# EAGLE schematic iobaord (EAGLE 9.6.2)
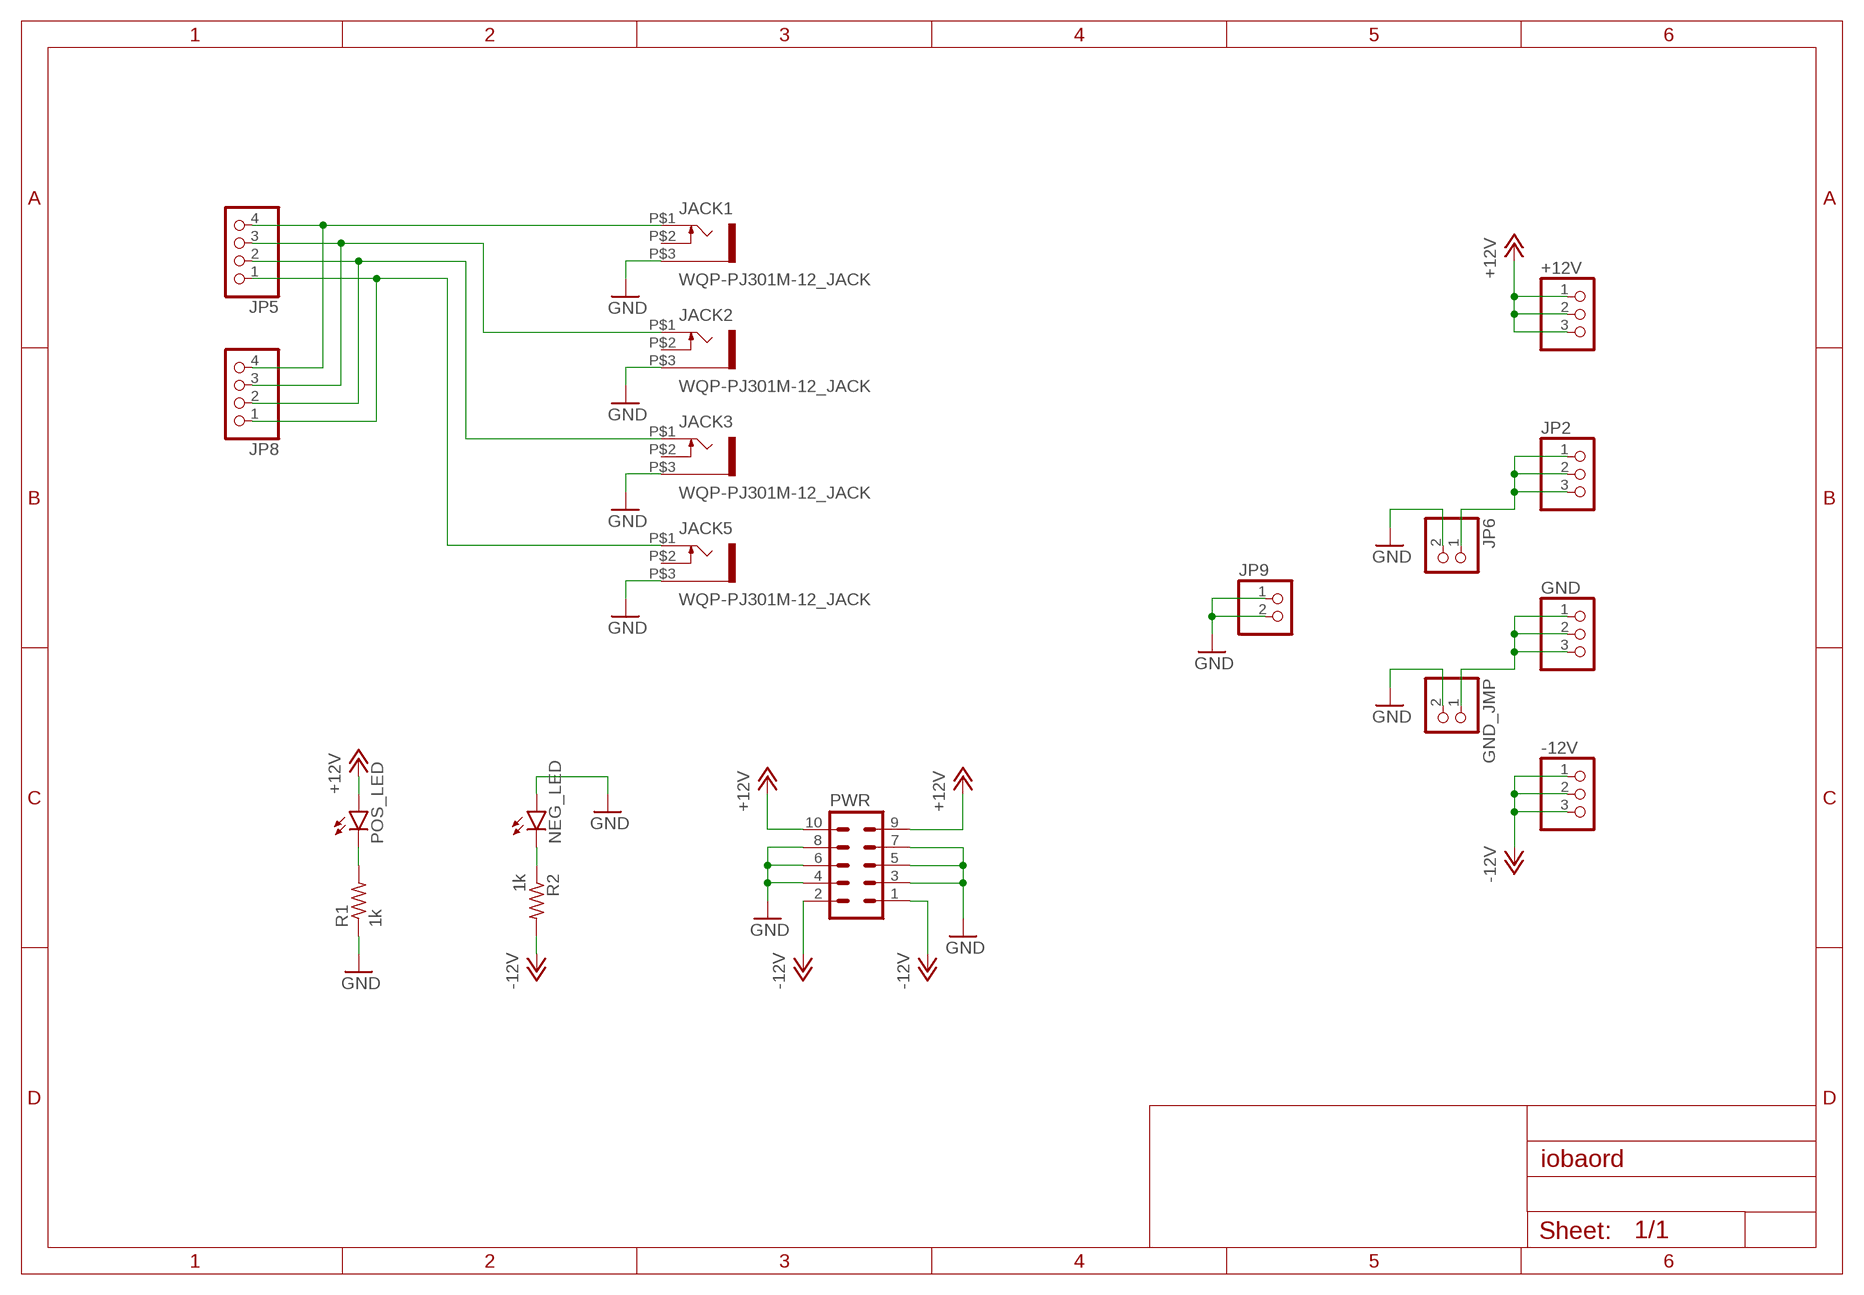
[diagram p0: schematic, sheet 1]

## Parts
+12V  PINHD-1X3  [1X03]
-12V  PINHD-1X3  [1X03]
GND  PINHD-1X3  [1X03]
GND_JMP  PINHD-1X2  [1X02]
JACK1  WQP-PJ301M-12_JACK  [WQP-PJ301M-12_JACK]
JACK2  WQP-PJ301M-12_JACK  [WQP-PJ301M-12_JACK]
JACK3  WQP-PJ301M-12_JACK  [WQP-PJ301M-12_JACK]
JACK5  WQP-PJ301M-12_JACK  [WQP-PJ301M-12_JACK]
JP2  PINHD-1X3  [1X03]
JP5  PINHD-1X4  [1X04]
JP6  PINHD-1X2  [1X02]
JP8  PINHD-1X4  [1X04]
JP9  PINHD-1X2  [1X02]
NEG_LED  LED3MM  [LED3MM]
POS_LED  LED3MM  [LED3MM]
PWR  ML10  [ML10]
R1  1k  R-US_0207/7  [0207/7]
R2  1k  R-US_0207/7  [0207/7]

## Nets
+12V: +12V.1 +12V.2 +12V.3 POS_LED.A PWR.9 PWR.10
-12V: -12V.1 -12V.2 -12V.3 PWR.1 PWR.2 R2.2
GND: GND_JMP.2 JACK1.P$3 JACK2.P$3 JACK3.P$3 JACK5.P$3 JP6.2 JP9.1 JP9.2 NEG_LED.A PWR.3 PWR.4 PWR.5 PWR.6 PWR.7 PWR.8 R1.1
N$1: POS_LED.K(C) R1.2
N$2: NEG_LED.K(C) R2.1
N$3: JACK1.P$1 JP5.4 JP8.4
N$5: JACK3.P$1 JP5.2 JP8.2
N$6: JP2.1 JP2.2 JP2.3 JP6.1
N$7: JACK5.P$1 JP5.1 JP8.1
N$9: GND.1 GND.2 GND.3 GND_JMP.1
N$10: JACK2.P$1 JP5.3 JP8.3
Unconnected: JACK1.P$2 JACK2.P$2 JACK3.P$2 JACK5.P$2

## Library data of the parts
+12V -12V GND JP2 = pinhead:PINHD-1X3: PIN HEADER
GND_JMP JP6 JP9 = pinhead:PINHD-1X2: PIN HEADER
JACK1-JACK3 JACK5 = thonkiconn:WQP-PJ301M-12_JACK
JP5 JP8 = pinhead:PINHD-1X4: PIN HEADER
NEG_LED POS_LED = led:LED: LED OSRAM: - CHIPLED LG R971, LG N971, LY N971, LG Q971, LY Q971, LO R971, LY R971 LH N974, LH R974 LS Q976, LO Q976, LY Q976 LO Q996 - Hyper CHIPLED LW Q18S LB Q993, LB Q99A, LB R99A - SideLED LS A670, LO A670, LY A670, LG A670, LP A670 LB A673, LV A673, LT A673, LW A673 LH A674 LY A675 LS A676, LA A676, LO A676, LY A676, LW A676 LS A679, LY A679, LG A679 - Hyper Micro SIDELED® LS Y876, LA Y876, LO Y876, LY Y876 LT Y87S - SmartLED LW L88C, LW L88S LB L89C, LB L89S, LG L890 LS L89K, LO L89K, LY L89K LS L896, LA L896, LO L896, LY L896 - TOPLED LS T670, LO T670, LY T670, LG T670, LP T670 LSG T670, LSP T670, LSY T670, LOP T670, LYG T670 LG T671, LOG T671, LSG T671 LB T673, LV T673, LT T673, LW T673 LH T674 LS T676, LA T676, LO T676, LY T676, LB T676, LH T676, LSB T676, LW T676 LB T67C, LV T67C, LT T67C, LS T67K, LO T67K, LY T67K, LW E67C LS E67B, LA E67B, LO E67B, LY E67B, LB E67C, LV E67C, LT E67C LW T67C LS T679, LY T679, LG T679 LS T770, LO T770, LY T770, LG T770, LP T770 LB T773, LV T773, LT T773, LW T773 LH T774 LS E675, LA E675, LY E675, LS T675 LS T776, LA T776, LO T776, LY T776, LB T776 LHGB T686 LT T68C, LB T68C - Hyper Mini TOPLED® LB M676 - Mini TOPLED Santana® LG M470 LS M47K, LO M47K, LY M47K Source: http://www.osram.convergy.de LUXEON: - LUMILED® LXK2-PW12-R00, LXK2-PW12-S00, LXK2-PW14-U00, LXK2-PW14-V00 LXK2-PM12-R00, LXK2-PM12-S00, LXK2-PM14-U00 LXK2-PE12-Q00, LXK2-PE12-R00, LXK2-PE12-S00, LXK2-PE14-T00, LXK2-PE14-U00 LXK2-PB12-K00, LXK2-PB12-L00, LXK2-PB12-M00, LXK2-PB14-N00, LXK2-PB14-P00, LXK2-PB14-Q00 LXK2-PR12-L00, LXK2-PR12-M00, LXK2-PR14-Q00, LXK2-PR14-R00 LXK2-PD12-Q00, LXK2-PD12-R00, LXK2-PD12-S00 LXK2-PH12-R00, LXK2-PH12-S00 LXK2-PL12-P00, LXK2-PL12-Q00, LXK2-PL12-R00 Source: www.luxeon.com KINGBRIGHT: KA-3528ASYC Source: www.kingbright.com
PWR = con-ml:ML10: HARTING; OC_FARNELL: unknown; OC_NEWARK: unknown
R1 R2 = rcl:R-US_: RESISTOR, American symbol; SPICEPREFIX: R